# Altium schematic sheet kr3_imp_3_2.SchDoc
size 420 x 297 mm; SheetNumber: 1; SheetTotal: 1
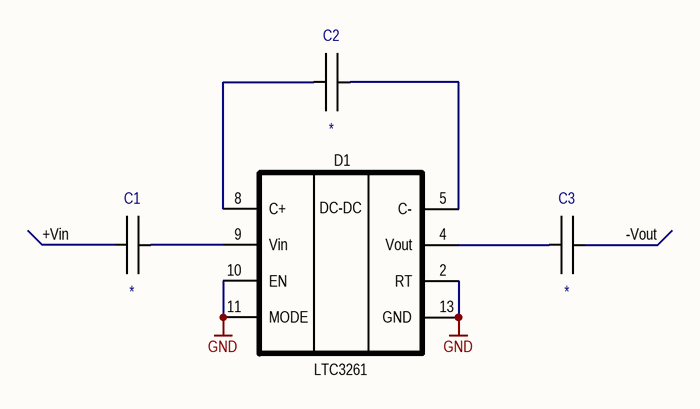
[diagram p0: kr3_imp_3_2.SchDoc]

## Parts
C1  *Ф ±* * * *, *  (value not drawn)
C2  *Ф ±* * * *, *  (value not drawn)
C3  *Ф ±* * * *, *  (value not drawn)
D1  LTC3261

## Nets
GND: D1.2(RT) D1.10(EN) D1.11(MODE) D1.13(GND)
+Vin: C1.2
-Vout: C3.1
NetC1_1: C1.1 D1.9(Vin)
NetC2_1: C2.1 D1.5(C-)
NetC2_2: C2.2 D1.8(C+)
NetC3_2: C3.2 D1.4(Vout)

## Notes on the sheet
- Перв.примен.
- Справ. №
- Подп. и дата
- Инв.№ дубл.
- Взам. инв. №
- Изм.
- Лист
- № докум.
- Подп.
- Дата
- Лит.
- Масса
- Масштаб
- Пров.
- Т.контр
- Разраб.
- Схема электрическая принципиальная
- 1
- Листов
- Инв № подл.
- Н.контр.
- Утв.
- Копировал
- Формат А3
- (in symbol LTC3261) DC-DC

## Library data of the parts
C1-C3 = C: Company: *; PartNumber: *; Tolerance: *; Voltage: *; Type: *; Package: *; Value: *